# EAGLE design TestKeyboardAdapter (EAGLE 9.4.2)
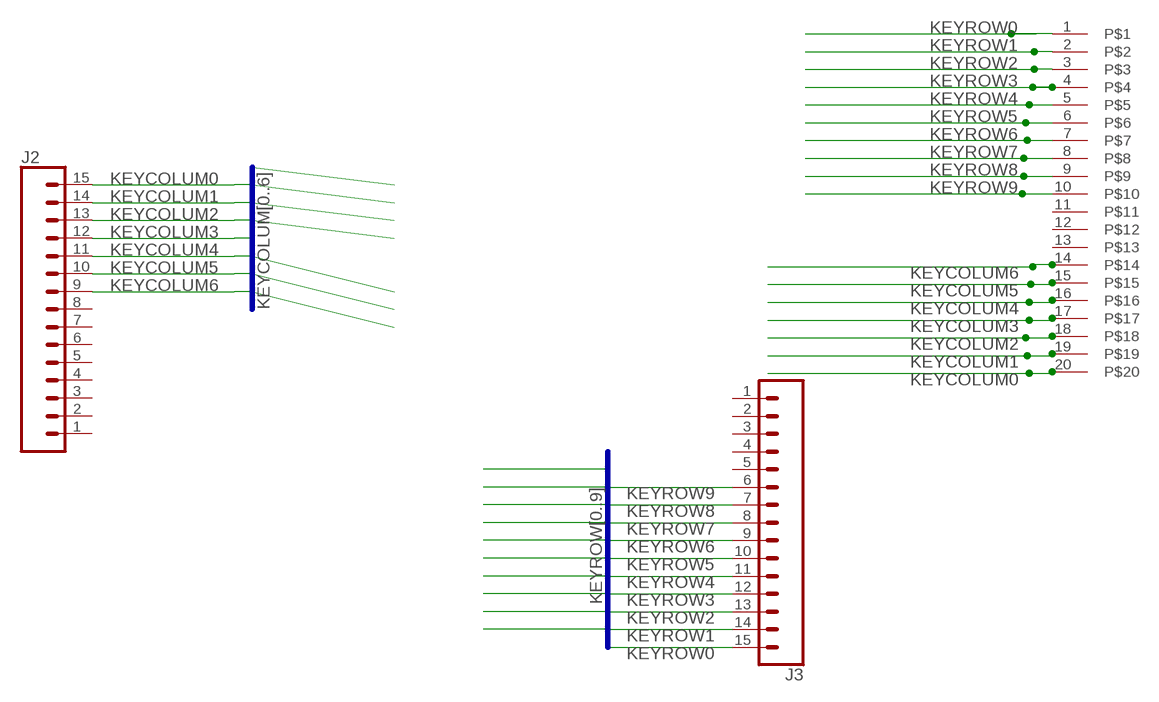
[diagram p0: schematic, sheet 1]

## Parts
J2  CONN_15  [1X15]
J3  CONN_15  [1X15]
U$1  FC1-20-L2-T-WT20PIN  [FC1-20-L2-T-WT]

## Nets
KEYCOLUM0: J2.15 U$1.20
KEYCOLUM1: J2.14 U$1.19
KEYCOLUM2: J2.13 U$1.18
KEYCOLUM3: J2.12 U$1.17
KEYCOLUM4: J2.11 U$1.16
KEYCOLUM5: J2.10 U$1.15
KEYCOLUM6: J2.9 U$1.14
KEYROW0: J3.15 U$1.1
KEYROW1: J3.14 U$1.2
KEYROW2: J3.13 U$1.3
KEYROW3: J3.12 U$1.4
KEYROW4: J3.11 U$1.5
KEYROW5: J3.10 U$1.6
KEYROW6: J3.9 U$1.7
KEYROW7: J3.8 U$1.8
KEYROW8: J3.7 U$1.9
KEYROW9: J3.6 U$1.10
Unconnected: J2.1 J2.2 J2.3 J2.4 J2.5 J2.6 J2.7 J2.8 J3.1 J3.2 J3.3 J3.4 J3.5 U$1.11 U$1.12 U$1.13

## Buses
KEYROW[0..9]
KEYCOLUM[0..6]

## Library data of the parts
J2 J3 = SparkFun-Connectors:CONN_15: Multi connection point. Often used as Generic Header-pin footprint for 0.1 inch spaced/style header connections On any of the 0.1 inch spaced packages, you can populate with these: Break Away Headers - Straight <https://www.sparkfun.com/products/116> (PRT-00116) Break Away Male Headers - Right Angle <https://www.sparkfun.com/products/553> (PRT-00553) Female Headers <https://www.sparkfun.com/products/115> (PRT-00115) Break Away Headers - Machine Pin <https://www.sparkfun.com/products/117> (PRT-00117) Break Away Female Headers - Swiss Machine Pin <https://www.sparkfun.com/products/743> (PRT-00743) For SCREWTERMINALS and SPRING TERMINALS visit here: Screw Terimnals on SparkFun.com <https://www.sparkfun.com/search/results?term=Screw+Terminals> (5mm/3.5mm/2.54mm spacing) This device is also useful as a general connection point to wire up your design to another part of your project. Our various solder wires solder well into these plated through hole pads. Hook-Up Wire - Assortment (Stranded, 22 AWG) <https://www.sparkfun.com/products/11375> (PRT-11375) Hook-Up Wire - Assortment (Solid Core, 22 AWG) <https://www.sparkfun.com/products/11367> (PRT-11367) View the entire wire category on our website here <https://www.sparkfun.com/categories/141> Special notes: Molex polarized connector foot print use with SKU : PRT-08231 with associated crimp pins and housings. 1MM SMD Version SKU: PRT-10208 NOTES ON THE VARIANTS LOCK and LOCK_LONGPADS... This footprint was designed to help hold the alignment of a through-hole component (i.e. 6-pin header) while soldering it into place. You may notice that each hole has been shifted either up or down by 0.005 of an inch from it's more standard position (which is a perfectly straight line). This slight alteration caused the pins (the squares in the middle) to touch the edges of the holes. Because they are alternating, it causes a "brace" to hold the component in place. 0.005 has proven to be the perfect amount of "off-center" position when using our standard breakaway headers. Although looks a little odd when you look at the bare footprint, once you have a header in there, the alteration is very hard to notice. Also,if you push a header all the way into place, it is covered up entirely on the bottom side.
U$1 = FPC:FC1-20-L2-T-WT20PIN

## Board
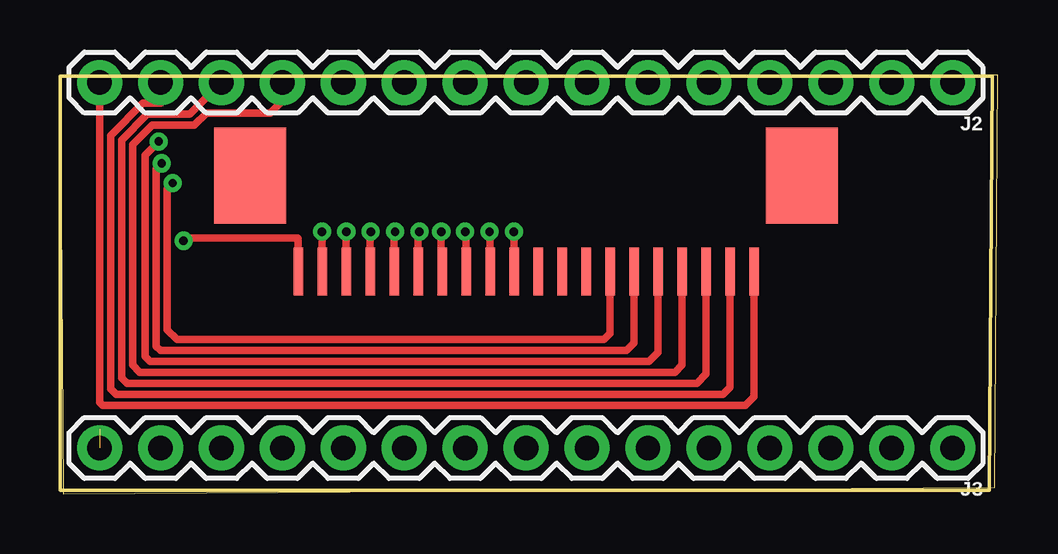
[diagram p1: board, top side]
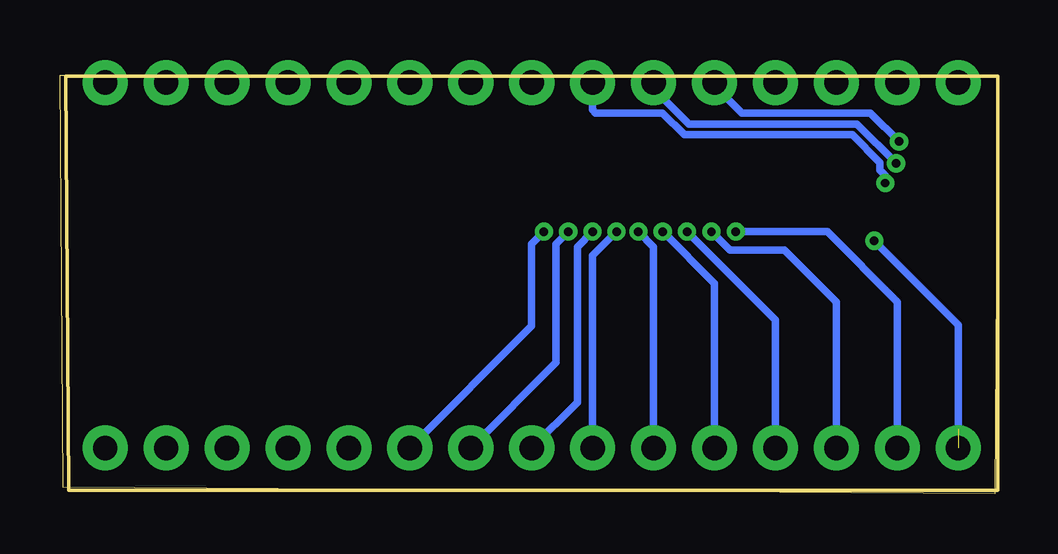
[diagram p2: board, bottom side, seen from below]

Size 39.1 x 17.45 mm. Coordinates in mm from the lower left corner, seen from the top.
Outline: 0.13,0 38.97,0.25 39.1,17.45 0,17.45 0.13,0
Copper layers (1*16): Top 0.035mm / dielectric 1.5mm / Bottom 0.035mm
Design rules "default": minimum track width 6mil, minimum drill 0.35mm, track to track 6mil, track to pad 6mil, pad to pad 6mil, via to via 6mil, smd to smd 6mil, copper to edge 40mil, drill to drill 6mil, minimum pad ring 10mil, minimum via ring 8mil, stop-mask expansion 4mil, vias tented up to drill 0mil, thermal gap 10mil
Milling: 6 lines

### Footprints (pad centres in the part's own frame; a part is rotated, then mirrored left to right if it is on the bottom)
1X15 = drill 1.016 pad 1.88: 1 0,0; 2 2.54,0; 3 5.08,0; 4 7.62,0; 5 10.16,0; 6 12.7,0; 7 15.24,0; 8 17.78,0; 9 20.32,0; 10 22.86,0; 11 25.4,0; 12 27.94,0; 13 30.48,0; 14 33.02,0; 15 35.56,0
FC1-20-L2-T-WT = smd 0.4 x 2: 1 -9.5,1; 2 -8.5,1; 3 -7.5,1; 4 -6.5,1; 5 -5.5,1; 6 -4.5,1; 7 -3.5,1; 8 -2.5,1; 9 -1.5,1; 10 -0.5,1; 11 0.5,1; 12 1.5,1; 13 2.5,1; 14 3.5,1; 15 4.5,1; 16 5.5,1; 17 6.5,1; 18 7.5,1; 19 8.5,1; 20 9.5,1 | smd 3 x 4: P$1 -11.5,5; P$2 11.5,5

### Placement (x,y rotation side)
J2  37.21,17.14 180 top
J3  37.21,1.91 180 top
U$1  19.43,8.25 0 top

### Tracks (layer width: path | path; a pad name or v marks a point on that pad's centre or on a via)
KEYCOLUM0
  Top 0.305: J2.15 1.65,3.81 1.78,3.68 28.57,3.68 28.93,4.04 U$1.20
KEYCOLUM1
  Top 0.305: U$1.19 27.93,4.44 27.64,4.14 2.34,4.14 2.11,4.37 2.11,14.93 3.46,16.28 4.19,16.28 J2.14
KEYCOLUM2
  Top 0.305: J2.13 5.41,15.82 3.64,15.82 2.56,14.75 2.56,4.83 2.79,4.6 26.54,4.6 26.93,4.99 U$1.18
KEYCOLUM3
  Top 0.305: U$1.17 25.93,5.36 25.63,5.05 3.33,5.05 3.02,5.36 3.02,14.56 3.83,15.37 5.6,15.37 6.11,15.88 8.76,15.88 9.27,16.38 J2.12
KEYCOLUM4  (via drill 0.35)
  Top 0.305: U$1.16 24.93,5.88 24.56,5.51 3.76,5.51 3.56,5.71 3.56,14.12 v4.12,14.68
  Bottom 0.305: v4.12,14.68 5.31,15.88 10.67,15.88 11.81,17.02 J2.11
KEYCOLUM5  (via drill 0.35)
  Top 0.305: v4.24,13.77 4.01,13.55 4.01,6.15 4.19,5.97 23.62,5.97 23.93,6.28 U$1.15
  Bottom 0.305: J2.10 14.35,16.89 12.88,15.42 5.88,15.42 v4.24,13.77
KEYCOLUM6  (via drill 0.35)
  Top 0.305: U$1.14 22.93,6.67 22.68,6.43 4.88,6.43 4.47,6.83 4.47,12.72 v4.7,12.95
  Bottom 0.305: v4.7,12.95 4.7,13.27 4.92,13.49 4.92,13.81 6.07,14.96 13.07,14.96 13.98,15.88 16.76,15.88 16.89,16 J2.9
KEYROW0  (via drill 0.35)  (1 unrouted)
  Top 0.305: U$1.1 9.93,10.64 9.91,10.67 5.28,10.67 v5.15,10.54
  Bottom 0.305: v5.15,10.54 1.65,7.04 1.65,2.7
KEYROW1  (via drill 0.35)
  Top 0.305: U$1.2 10.93,10.91 v10.92,10.92
  Bottom 0.305: v10.92,10.92 7.11,10.92 4.19,8 J3.14
KEYROW2  (via drill 0.35)
  Top 0.305: U$1.3 v11.93,10.91 v11.94,10.92
  Bottom 0.305: v11.94,10.92 11.18,10.16 8.89,10.16 6.73,8 J3.13
KEYROW3  (via drill 0.35)
  Top 0.305: U$1.4 12.93,10.9 v12.95,10.92
  Bottom 0.305: v12.95,10.92 9.27,7.24 J3.12
KEYROW4  (via drill 0.35)
  Top 0.305: U$1.5 13.93,10.88 v13.97,10.92
  Bottom 0.305: v13.97,10.92 11.81,8.76 J3.11
KEYROW5  (via drill 0.35)
  Top 0.305: U$1.6 14.93,10.87 v14.99,10.92
  Bottom 0.305: v14.99,10.92 14.35,10.29 J3.10
KEYROW6  (via drill 0.35)
  Top 0.305: U$1.7 15.89,9.29 v15.89,10.92
  Bottom 0.305: v15.89,10.92 16.89,9.93 16.89,9.53 J3.9
KEYROW7  (via drill 0.35)
  Top 0.305: U$1.8 16.93,10.88 v16.89,10.92
  Bottom 0.305: v16.89,10.92 17.53,10.29 17.53,3.81 J3.8
KEYROW8  (via drill 0.35)
  Top 0.305: U$1.9 17.93,10.9 v17.91,10.92
  Bottom 0.305: v17.91,10.92 18.41,10.41 18.41,5.46 J3.7
KEYROW9  (via drill 0.35)
  Top 0.305: U$1.10 v18.93,10.91 v18.92,10.92
  Bottom 0.305: v18.92,10.92 19.43,10.41 19.43,6.99 J3.6